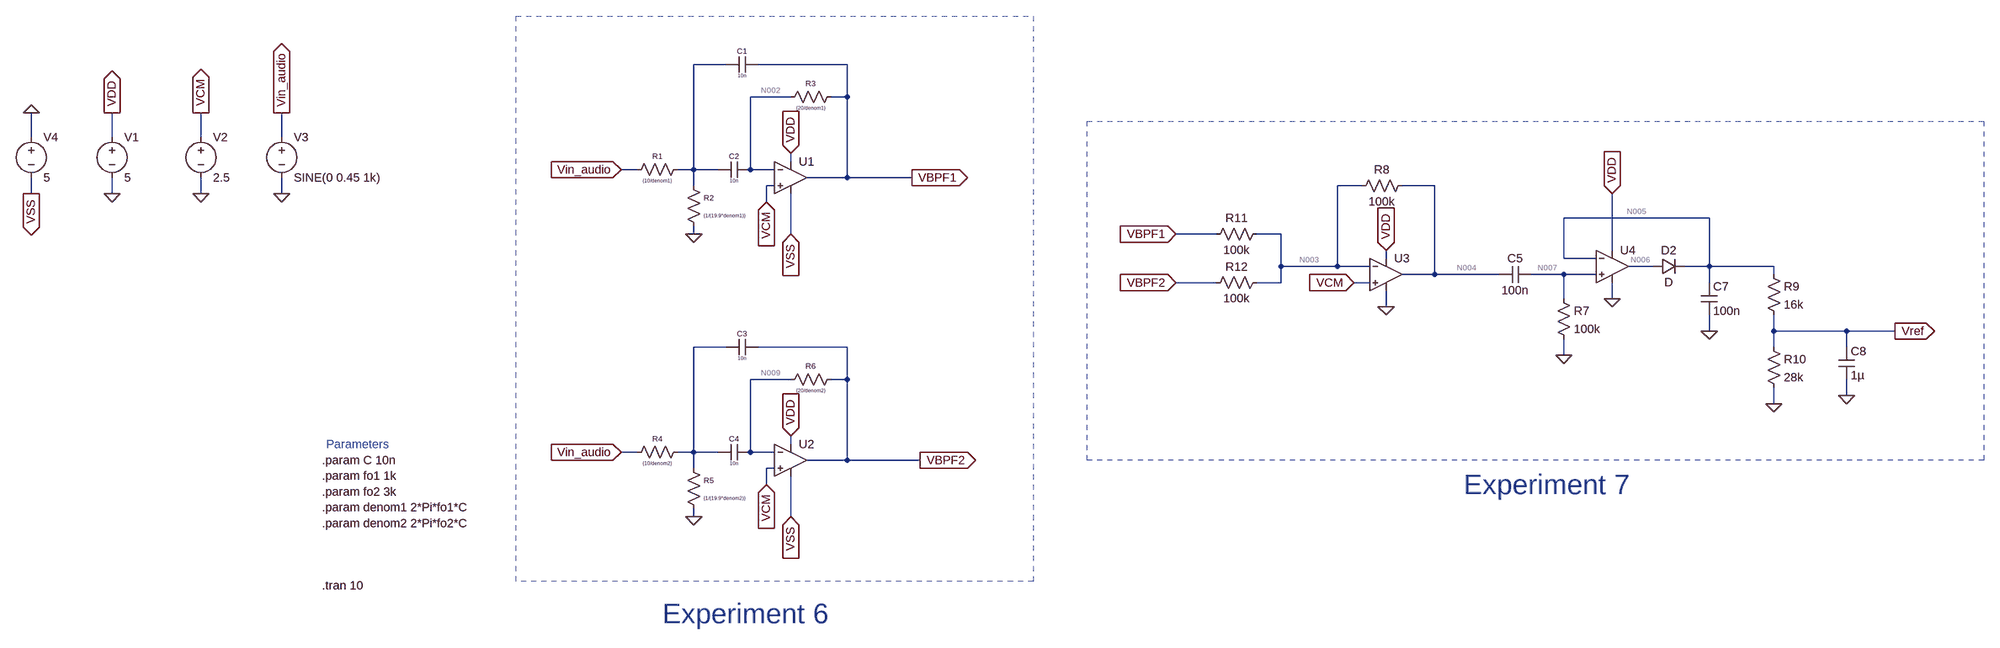
[diagram p0: schematic prelab7.asc]
prelab7.asc, the LTspice schematic file:
Version 4
SHEET 1 2836 680
WIRE 176 -512 112 -512
WIRE 416 -512 240 -512
WIRE 304 -448 224 -448
WIRE 416 -448 416 -512
WIRE 416 -448 384 -448
WIRE -1200 -368 -1200 -416
WIRE -1040 -368 -1040 -416
WIRE -864 -368 -864 -416
WIRE -704 -368 -704 -416
WIRE 304 -320 304 -336
WIRE 0 -304 -32 -304
WIRE 112 -304 112 -512
WIRE 112 -304 80 -304
WIRE 160 -304 112 -304
WIRE 224 -304 224 -448
WIRE 272 -304 224 -304
WIRE 416 -288 416 -448
WIRE 416 -288 336 -288
WIRE 544 -288 416 -288
WIRE 112 -272 112 -304
WIRE 272 -272 256 -272
WIRE 1600 -272 1552 -272
WIRE 1744 -272 1680 -272
WIRE -1200 -256 -1200 -288
WIRE -1040 -256 -1040 -288
WIRE -864 -256 -864 -288
WIRE -704 -256 -704 -288
WIRE 256 -240 256 -272
WIRE 2288 -208 2000 -208
WIRE 112 -176 112 -192
WIRE 304 -176 304 -256
WIRE 1312 -176 1232 -176
WIRE 1440 -176 1392 -176
WIRE 2096 -144 2096 -256
WIRE 1648 -128 1648 -144
WIRE 2000 -128 2000 -208
WIRE 2064 -128 2000 -128
WIRE 1440 -112 1440 -176
WIRE 1552 -112 1552 -272
WIRE 1552 -112 1440 -112
WIRE 1616 -112 1552 -112
WIRE 2176 -112 2128 -112
WIRE 2288 -112 2288 -208
WIRE 2288 -112 2240 -112
WIRE 2416 -112 2288 -112
WIRE 1744 -96 1744 -272
WIRE 1744 -96 1680 -96
WIRE 1872 -96 1744 -96
WIRE 2000 -96 1936 -96
WIRE 2064 -96 2000 -96
WIRE 2416 -96 2416 -112
WIRE 1312 -80 1232 -80
WIRE 1440 -80 1440 -112
WIRE 1440 -80 1392 -80
WIRE 1616 -80 1584 -80
WIRE 2288 -80 2288 -112
WIRE 2000 -48 2000 -96
WIRE 2096 -48 2096 -80
WIRE 1648 -32 1648 -64
WIRE 2288 16 2288 -16
WIRE 2416 16 2416 -16
WIRE 2560 16 2416 16
WIRE 2656 16 2560 16
WIRE 176 48 112 48
WIRE 416 48 240 48
WIRE 2416 48 2416 16
WIRE 2560 48 2560 16
WIRE 2000 64 2000 32
WIRE 304 112 224 112
WIRE 416 112 416 48
WIRE 416 112 384 112
WIRE 2560 144 2560 112
WIRE 2416 160 2416 128
WIRE 304 240 304 224
WIRE 0 256 -32 256
WIRE 112 256 112 48
WIRE 112 256 80 256
WIRE 160 256 112 256
WIRE 224 256 224 112
WIRE 272 256 224 256
WIRE 416 272 416 112
WIRE 416 272 336 272
WIRE 560 272 416 272
WIRE 112 288 112 256
WIRE 272 288 256 288
WIRE 256 320 256 288
WIRE 112 384 112 368
WIRE 304 384 304 304
FLAG 112 -176 0
FLAG 304 -176 VSS
IOPIN 304 -176 In
FLAG 304 -336 VDD
IOPIN 304 -336 In
FLAG -32 -304 Vin_audio
IOPIN -32 -304 In
FLAG 112 384 0
FLAG 304 384 VSS
IOPIN 304 384 In
FLAG 304 224 VDD
IOPIN 304 224 In
FLAG -32 256 Vin_audio
IOPIN -32 256 In
FLAG 560 272 VBPF2
IOPIN 560 272 Out
FLAG 544 -288 VBPF1
IOPIN 544 -288 Out
FLAG 256 -240 VCM
IOPIN 256 -240 In
FLAG 256 320 VCM
IOPIN 256 320 In
FLAG -1040 -256 0
FLAG -864 -256 0
FLAG -704 -256 0
FLAG -1040 -416 VDD
IOPIN -1040 -416 Out
FLAG -864 -416 VCM
IOPIN -864 -416 Out
FLAG -704 -416 Vin_audio
IOPIN -704 -416 Out
FLAG -1200 -416 0
FLAG -1200 -256 VSS
IOPIN -1200 -256 Out
FLAG 2096 -48 0
FLAG 2096 -256 VDD
IOPIN 2096 -256 In
FLAG 2288 16 0
FLAG 2416 160 0
FLAG 2560 144 0
FLAG 2000 64 0
FLAG 1648 -144 VDD
IOPIN 1648 -144 In
FLAG 1648 -32 0
FLAG 1584 -80 VCM
IOPIN 1584 -80 In
FLAG 1232 -176 VBPF1
IOPIN 1232 -176 In
FLAG 1232 -80 VBPF2
IOPIN 1232 -80 In
FLAG 2656 16 Vref
IOPIN 2656 16 Out
SYMBOL res 96 -320 R90
WINDOW 0 0 56 VBottom 1
WINDOW 3 32 56 VTop 0
SYMATTR InstName R1
SYMATTR Value {10/denom1}
SYMBOL res 96 -288 R0
WINDOW 0 36 40 Left 1
WINDOW 3 36 76 Left 0
SYMATTR InstName R2
SYMATTR Value {1/(19.9*denom1)}
SYMBOL res 288 -432 R270
WINDOW 0 32 56 VTop 1
WINDOW 3 0 56 VBottom 0
SYMATTR InstName R3
SYMATTR Value {20/denom1}
SYMBOL cap 240 -528 R90
WINDOW 0 0 32 VBottom 1
WINDOW 3 32 32 VTop 0
SYMATTR InstName C1
SYMATTR Value 10n
SYMBOL cap 224 -320 R90
WINDOW 0 0 32 VBottom 1
WINDOW 3 32 32 VTop 0
SYMATTR InstName C2
SYMATTR Value 10n
SYMBOL res 96 240 R90
WINDOW 0 0 56 VBottom 1
WINDOW 3 32 56 VTop 0
SYMATTR InstName R4
SYMATTR Value {10/denom2}
SYMBOL res 96 272 R0
WINDOW 0 36 40 Left 1
WINDOW 3 36 76 Left 0
SYMATTR InstName R5
SYMATTR Value {1/(19.9*denom2)}
SYMBOL res 288 128 R270
WINDOW 0 32 56 VTop 1
WINDOW 3 0 56 VBottom 0
SYMATTR InstName R6
SYMATTR Value {20/denom2}
SYMBOL cap 240 32 R90
WINDOW 0 0 32 VBottom 1
WINDOW 3 32 32 VTop 0
SYMATTR InstName C3
SYMATTR Value 10n
SYMBOL cap 224 240 R90
WINDOW 0 0 32 VBottom 1
WINDOW 3 32 32 VTop 0
SYMATTR InstName C4
SYMATTR Value 10n
SYMBOL OpAmps\\UniversalOpAmp1 304 -288 R0
SYMATTR InstName U1
SYMBOL OpAmps\\UniversalOpAmp1 304 272 R0
SYMATTR InstName U2
SYMBOL voltage -1040 -384 R0
WINDOW 123 0 0 Left 0
WINDOW 39 0 0 Left 0
SYMATTR InstName V1
SYMATTR Value 5
SYMBOL voltage -864 -384 R0
WINDOW 123 0 0 Left 0
WINDOW 39 0 0 Left 0
SYMATTR InstName V2
SYMATTR Value 2.5
SYMBOL voltage -704 -384 R0
WINDOW 123 0 0 Left 0
WINDOW 39 0 0 Left 0
SYMATTR InstName V3
SYMATTR Value SINE(0 0.45 1k)
SYMBOL voltage -1200 -384 R0
WINDOW 123 0 0 Left 0
WINDOW 39 0 0 Left 0
SYMATTR InstName V4
SYMATTR Value 5
SYMBOL diode 2176 -96 R270
WINDOW 0 32 32 VTop 2
WINDOW 3 0 32 VBottom 2
SYMATTR InstName D2
SYMBOL cap 2272 -80 R0
SYMATTR InstName C7
SYMATTR Value 100n
SYMBOL res 2400 -112 R0
SYMATTR InstName R9
SYMATTR Value 16k
SYMBOL res 2400 32 R0
SYMATTR InstName R10
SYMATTR Value 28k
SYMBOL cap 2544 48 R0
SYMATTR InstName C8
SYMATTR Value 1µ
SYMBOL OpAmps\\UniversalOpAmp2 2096 -112 R0
SYMATTR InstName U4
SYMBOL OpAmps\\UniversalOpAmp 1648 -96 R0
SYMATTR InstName U3
SYMBOL cap 1936 -112 R90
WINDOW 0 0 32 VBottom 2
WINDOW 3 32 32 VTop 2
SYMATTR InstName C5
SYMATTR Value 100n
SYMBOL res 1984 -64 R0
SYMATTR InstName R7
SYMATTR Value 100k
SYMBOL res 1696 -288 R90
WINDOW 0 0 56 VBottom 2
WINDOW 3 32 56 VTop 2
SYMATTR InstName R8
SYMATTR Value 100k
SYMBOL res 1408 -192 R90
WINDOW 0 0 56 VBottom 2
WINDOW 3 32 56 VTop 2
SYMATTR InstName R11
SYMATTR Value 100k
SYMBOL res 1408 -96 R90
WINDOW 0 0 56 VBottom 2
WINDOW 3 32 56 VTop 2
SYMATTR InstName R12
SYMATTR Value 100k
TEXT -624 272 Left 2 !.param C 10n\n.param fo1 1k\n.param fo2 3k\n.param denom1 2*Pi*fo1*C\n.param denom2 2*Pi*fo2*C
TEXT -616 240 Left 2 ;Parameters
TEXT -624 520 Left 2 !.tran 10
TEXT 1968 320 Center 5 ;Experiment 7
TEXT 216 576 Center 5 ;Experiment 6
RECTANGLE Normal 784 512 -240 -608 2
RECTANGLE Normal 2832 272 1056 -400 2

The netlist it stands for:
* prelab7.asc
R1 N001 Vin_audio {10/denom1}
R2 N001 0 {1/(19.9*denom1)}
R3 N002 VBPF1 {20/denom1}
C1 VBPF1 N001 10n
C2 N002 N001 10n
R4 N008 Vin_audio {10/denom2}
R5 N008 0 {1/(19.9*denom2)}
R6 N009 VBPF2 {20/denom2}
C3 VBPF2 N008 10n
C4 N009 N008 10n
XU1 VCM N002 VDD VSS VBPF1 level1 Avol=1Meg GBW=10Meg Vos=0 En=0 Enk=0 In=0 Ink=0 Rin=500Meg  ; pins In+ In- V+ V- OUT
XU2 VCM N009 VDD VSS VBPF2 level1 Avol=1Meg GBW=10Meg Vos=0 En=0 Enk=0 In=0 Ink=0 Rin=500Meg  ; pins In+ In- V+ V- OUT
V1 VDD 0 5
V2 VCM 0 2.5
V3 Vin_audio 0 SINE(0 0.45 1k)
V4 0 VSS 5
D2 N006 N005 D
C7 N005 0 100n
R9 N005 Vref 16k
R10 Vref 0 28k
C8 Vref 0 1µ
XU4 N007 N005 VDD 0 N006 level2 Avol=1Meg GBW=10Meg Slew=10Meg Ilimit=25m Rail=0 Vos=0 En=0 Enk=0 In=0 Ink=0 Rin=500Meg  ; pins In+ In- V+ V- OUT
XU3 VCM N003 VDD 0 N004 level1 Avol=1Meg GBW=10Meg Vos=0 En=0 Enk=0 In=0 Ink=0 Rin=500Meg  ; pins In+ In- V+ V- OUT
C5 N007 N004 100n
R7 N007 0 100k
R8 N004 N003 100k
R11 N003 VBPF1 100k
R12 N003 VBPF2 100k
.model D D
.lib standard.dio
.param C 10n
.param fo1 1k
.param fo2 3k
.param denom1 2*Pi*fo1*C
.param denom2 2*Pi*fo2*C
* Parameters
.tran 10
* Experiment 7
* Experiment 6
.lib UniversalOpAmp1.lib
.lib UniversalOpAmp2.lib
.backanno
.end

* Results of the author's LTspice run, read from the files saved beside the schematic
* Operating Point, zero values left out:
*   V(n002) = 2.5 V
*   V(vbpf1) = 2.502 V
*   V(n009) = 2.5 V
*   V(vbpf2) = 2.501 V
*   V(vcm) = 2.5 V
*   V(vdd) = 5 V
*   V(vss) = -5 V
*   V(n006) = 346.3 mV
*   V(n005) = 502.1 µV
*   V(vref) = 319.5 µV
*   V(n007) = 499.9 µV
*   V(n003) = 2.5 V
*   V(n004) = 2.498 V
*   I(D2) = 6.412 nA
*   I(R12) = -5.305 nA
*   I(R11) = -15.92 nA
*   I(R8) = -21.22 nA
*   I(R7) = 4.999 nA
*   I(R10) = 11.41 nA
*   I(R9) = 11.41 nA
*   I(R6) = -5 nA
*   I(R3) = -5 nA
*   I(V4) = -30 nA
*   I(V2) = -10 nA
*   I(V1) = -127 µA